# EAGLE schematic wiring (EAGLE 9.5.0)
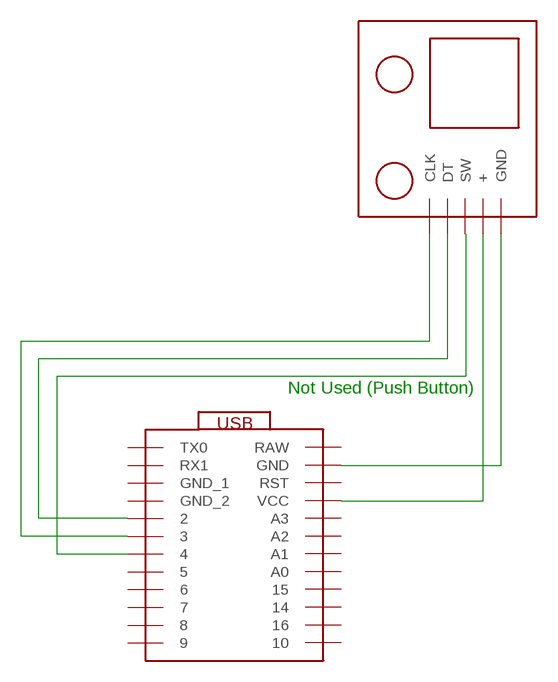
[diagram p0: schematic, sheet 1]

## Parts
U$1  ARDUINOMICROCLONE  [ARDUINOMICROCLONE]
U$2  ENCODER  [ENCODER]

## Nets
N$1: U$1.GND U$2.GND
N$2: U$1.VCC U$2.+
N$3: U$1.2 U$2.DT
N$4: U$1.3 U$2.CLK
N$5: U$1.4 U$2.SW
Unconnected: U$1.5 U$1.6 U$1.7 U$1.8 U$1.9 U$1.10 U$1.14 U$1.15 U$1.16 U$1.A0 U$1.A1 U$1.A2 U$1.A3 U$1.GND_2(GND_1) U$1.GND_3(GND_2) U$1.RAW U$1.RST U$1.RX1 U$1.TX0

## Notes on the sheet
- Not Used (Push Button)

## Library data of the parts
U$1 = untitled:ARDUINOMICROCLONE: Arduino Micro Clone
U$2 = untitled:ENCODER